# Altium schematic sheet MIXR Input - Instrument Inputs.SchDoc: Instrument Inputs
size B; Organization: Midnight Sun Solar Rayce Car Team; Address1: University of Waterloo; Address2: 200 University Ave W; Address3: Waterloo, ON, Canada; Address4: N2L 3E9; DocumentNumber: 3; SheetNumber: 3; SheetTotal: 14; Website: www.uwmidsun.com; ProjectName: ProjectName
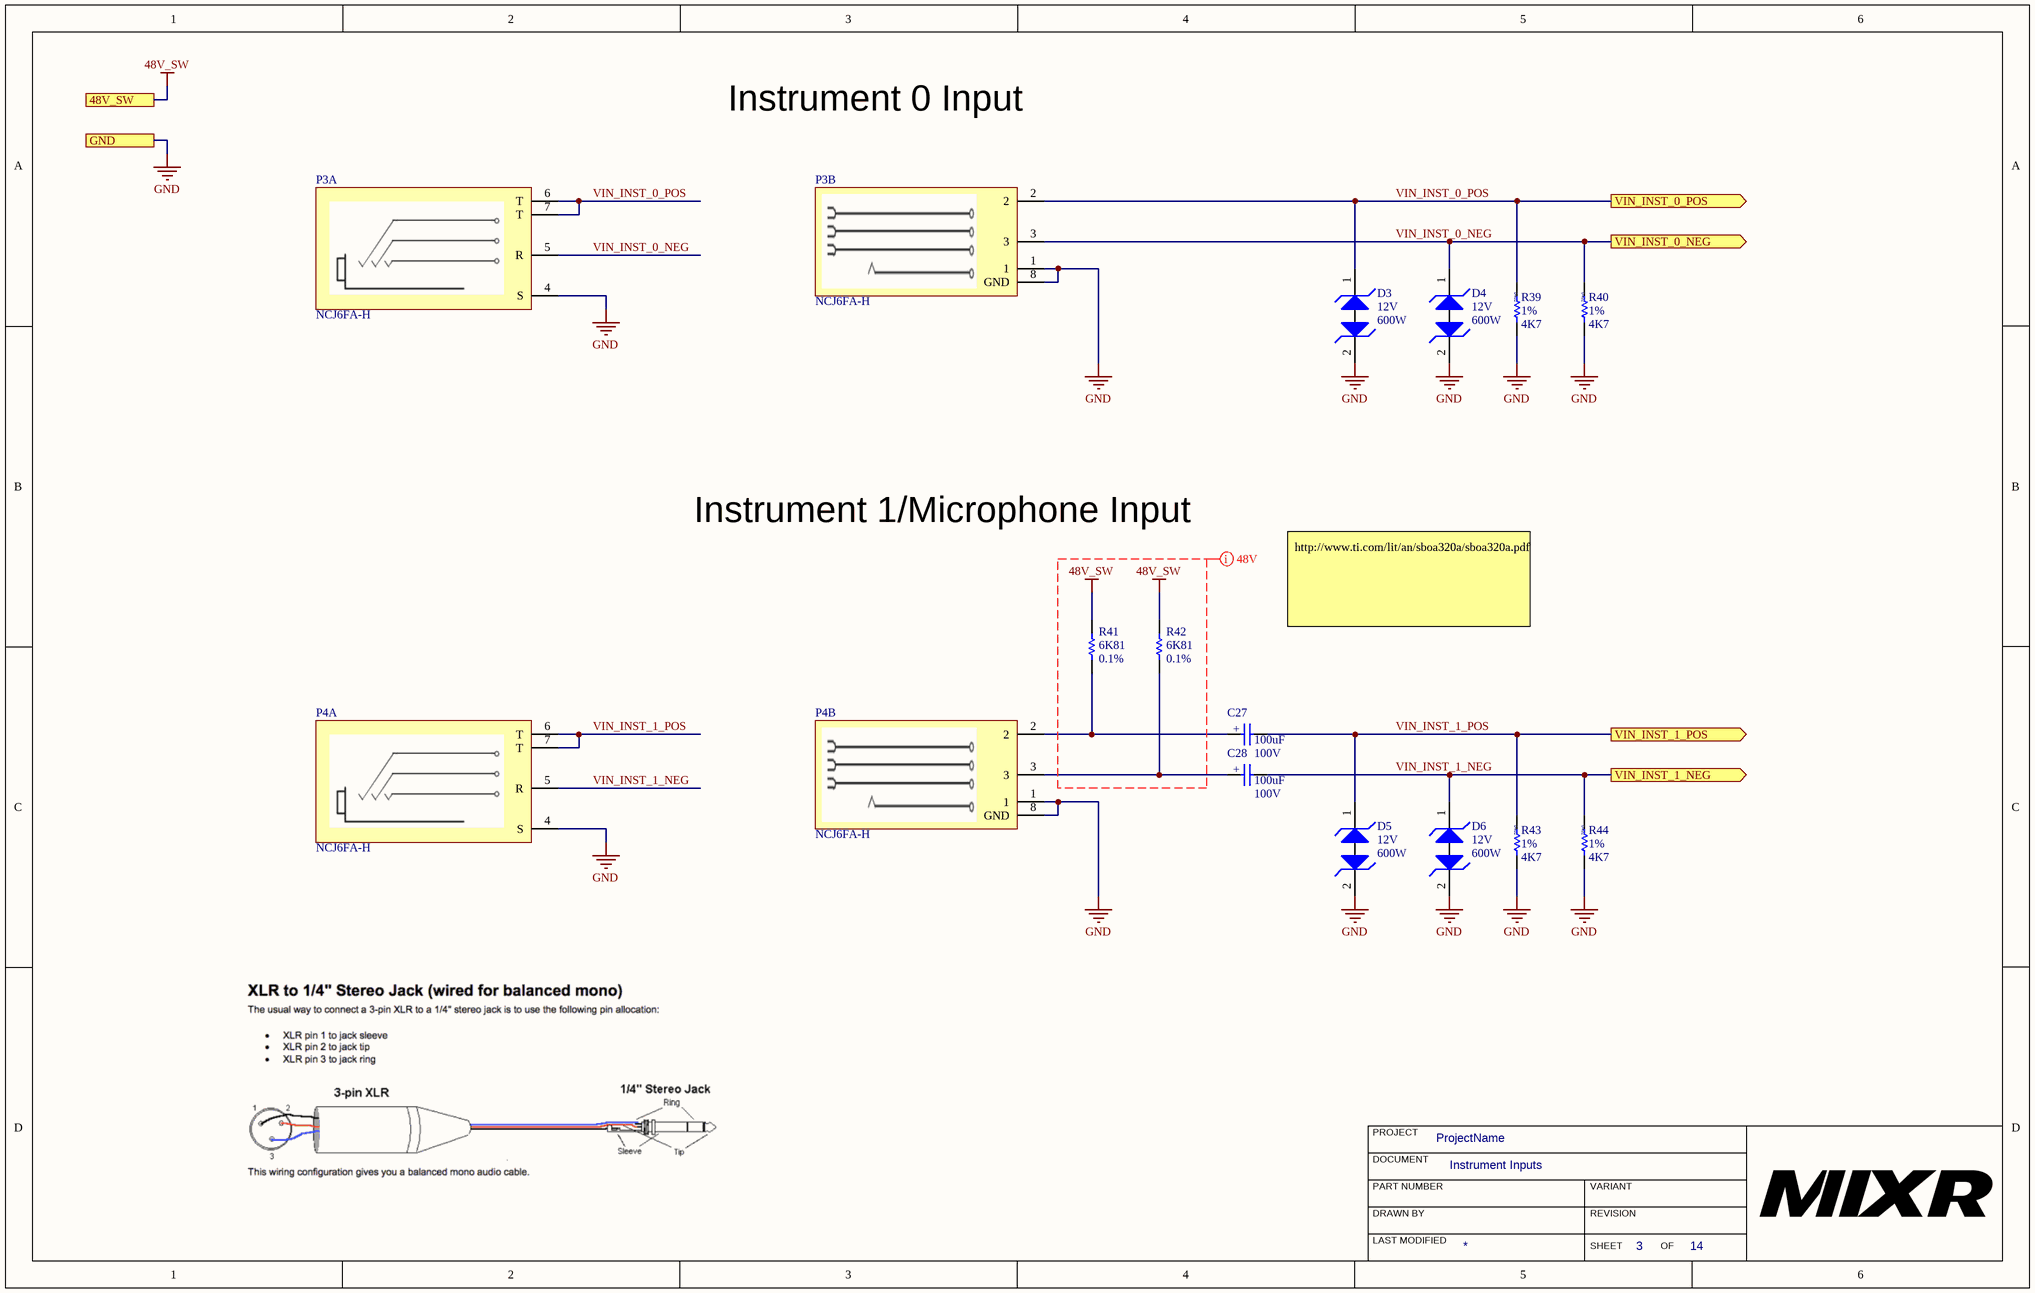
[diagram p0: MIXR Input - Instrument Inputs.SchDoc]

## Parts
C27  Capacitance: 100uF  Voltage Rating: 100V  [CAP ALUM RADIAL 10x20]  (hidden comment: CAP ALUM 100UF 20% 100V RADIAL)
C28  Capacitance: 100uF  Voltage Rating: 100V  [CAP ALUM RADIAL 10x20]  (hidden comment: CAP ALUM 100UF 20% 100V RADIAL)
D3  Voltage - Reverse Standoff (Typ): 12V  Power - Peak Pulse: 600W  [DO-214AA Diode - BI]  (hidden comment: DIODE TVS 12VWM 19.6VC DO-214AA (SMB))
D4  Voltage - Reverse Standoff (Typ): 12V  Power - Peak Pulse: 600W  [DO-214AA Diode - BI]  (hidden comment: DIODE TVS 12VWM 19.6VC DO-214AA (SMB))
D5  Voltage - Reverse Standoff (Typ): 12V  Power - Peak Pulse: 600W  [DO-214AA Diode - BI]  (hidden comment: DIODE TVS 12VWM 19.6VC DO-214AA (SMB))
D6  Voltage - Reverse Standoff (Typ): 12V  Power - Peak Pulse: 600W  [DO-214AA Diode - BI]  (hidden comment: DIODE TVS 12VWM 19.6VC DO-214AA (SMB))
P3  Manufacturer Part Number: NCJ6FA-H  [CONN XLR-TRS COMBO 3 POLE]  (hidden comment: CONN XLR-TRS COMBO 3 POLE)  (parts A,B of 2)
P4  Manufacturer Part Number: NCJ6FA-H  [CONN XLR-TRS COMBO 3 POLE]  (hidden comment: CONN XLR-TRS COMBO 3 POLE)  (parts A,B of 2)
R39  Tolerance: 1%  Resistance: 4K7  [RES 0402]  (hidden comment: RES 4.7K OHM 1% 1/10W 0402)
R40  Tolerance: 1%  Resistance: 4K7  [RES 0402]  (hidden comment: RES 4.7K OHM 1% 1/10W 0402)
R41  Tolerance: 0.1%  Resistance: 6K81  [RES, 0603]  (hidden comment: RES 6.81k OHM 0.1% 1/10W 0603)
R42  Tolerance: 0.1%  Resistance: 6K81  [RES, 0603]  (hidden comment: RES 6.81k OHM 0.1% 1/10W 0603)
R43  Tolerance: 1%  Resistance: 4K7  [RES 0402]  (hidden comment: RES 4.7K OHM 1% 1/10W 0402)
R44  Tolerance: 1%  Resistance: 4K7  [RES 0402]  (hidden comment: RES 4.7K OHM 1% 1/10W 0402)

## Ports
48V_SW, GND, VIN_INST_0_NEG (out), VIN_INST_0_POS (out), VIN_INST_1_NEG (out), VIN_INST_1_POS (out)

## Nets
48V_SW: R41.1 R42.1 ; port 48V_SW
GND: D3.2(Cathode2) D4.2(Cathode2) D5.2(Cathode2) D6.2(Cathode2) P3.1 P3.4(S) P3.8(GND) P4.1 P4.4(S) P4.8(GND) R39.2 R40.2 R43.2 R44.2 ; port GND
VIN_INST_0_NEG: D4.1(Cathode1) P3.3 P3.5(R) R40.1 ; port VIN_INST_0_NEG
VIN_INST_0_POS: D3.1(Cathode1) P3.2 P3.6(T) P3.7(T) R39.1 ; port VIN_INST_0_POS
VIN_INST_1_NEG: C28.2 D6.1(Cathode1) P4.5(R) R44.1 ; port VIN_INST_1_NEG
VIN_INST_1_POS: C27.2 D5.1(Cathode1) P4.6(T) P4.7(T) R43.1 ; port VIN_INST_1_POS
NetC27_1: C27.1 P4.2 R41.2
NetC28_1: C28.1 P4.3 R42.2

## Layout directives
mark named 48V: 48V_SW

## Notes on the sheet
- Instrument 0 Input
- Instrument 1/Microphone Input
- http://www.ti.com/lit/an/sboa320a/sboa320a.pdf
- PROJECT
- DOCUMENT
- DRAWN BY
- LAST MODIFIED
- PART NUMBER
- REVISION
- SHEET
- VARIANT
- OF
- (in symbol CAP ALUM 100UF 20% 100V RADIAL) +

## Library data of the parts
C27 C28 = CAP ALUM 100UF 20% 100V RADIAL: Manufacturer: Nichicon; Manufacturer Part Number: UFW2A101MPD1TD; Ripple Current: 350mA; Life (Hours): 2000Hour; Supplier 1: Digi-Key; RoHS: Yes; Stock 1: 465; Pricing 1: 1=0.72000, 10=0.53000, 100=0.36360 (USD); Supplier Part Number 1: 493-11050-1-ND; Category: Aluminum Electrolytic Capacitors; Mount: Through Hole; Case/Package: Radial; Min Operating Temperature: -40°C; Max Operating Temperature: 85°C; Package Quantity: 500; Packaging: Tape and Reel; Tolerance: 20%; Lead Pitch: 0.197inch; Height - Seated (Max): 0.866inch; ComponentLink1URL: https://datasheet.ciiva.com/29547/e-fw-29547515.pdf?src-supplier=Digi-Key; ComponentLink1Description: https://datasheet.ciiva.com/29547/e-fw-29547515.pdf?src-supplier=Digi-Key; ComponentLink2URL: https://datasheet.ciiva.com/29547/e-fw-29547516.pdf?src-supplier=Digi-Key; ComponentLink2Description: https://datasheet.ciiva.com/29547/e-fw-29547516.pdf?src-supplier=Digi-Key
D3-D6 = DIODE TVS 12VWM 19.6VC DO-214AA (SMB): TVS DIODE 12V 19.6V DO214AA; Manufacturer: Vishay Semiconductor Diodes Division; Manufacturer Part Number: SMBJ12CD-M3/H; Type: Zener; Voltage - Breakdown (Min): 13.5V; Current - Peak Pulse (10/1000µs): 30.6A; Power Line Protection: No; Supplier 1: Digi-Key; RoHS: RoHS Compliant; Category: Circuit Protection; Stock 1: 4469; Pricing 1: 1=0.69, 10=0.565, 25=0.516, 100=0.3841, 250=0.34808 (CAD); Packaging: Cut Tape (CT); Part Status: Active; Voltage - Clamping (Max) @ Ipp: 19.6V; Applications: General Purpose; Capacitance @ Frequency: -; Operating Temperature: -55°C ~ 150°C (TJ); Mounting Type: Surface Mount; Package / Case: DO-214AA, SMB; Supplier Device Package: DO-214AA (SMBJ); ComponentLink1URL: http://www.vishay.com/docs/87606/87606.pdf; ComponentLink1Description: http://www.vishay.com/docs/87606/87606.pdf; Supplier Part Number 1: SMBJ12CD-M3/HGICT-ND
P3 P4 = CONN XLR-TRS COMBO 3 POLE: XLR Connectors A SERIES COMBO;3POLE FEM;PCB HOR; Manufacturer_Name: Neutrik; Body Material: Metal; Gender: Female; Current Rating: 3A; Voltage Rating: 50V; Number of Positions: 3; Number of Ports: 1; Number of Contacts: 6; Connector Type: Socket; Datasheet Link: http://www.neutrik.com/zoolu-website/media/download/13540/Product+Guide+-+Section+XLR; Manufacturer_Part_Number: NCJ6FA-H; Mouser Part Number: 568-NCJ6FA-H; Mouser Price/Stock: https://www.mouser.com/Search/Refine.aspx?Keyword=568-NCJ6FA-H; Supplier 1: Mouser; Supplier Part Number 1: 568-NCJ6FA-H; Manufacturer: Neutrik; Stock 1: 3848; Pricing 1: 1 = 2.06000, 10 = 1.96000, 50 = 1.86000, 100 = 1.80000, 1000 = 1.77000, 10000 = 1.77000 (USD); RoHS: Yes; Case/Package: Metal; Number of Pins: 3; Weight: 0.388014oz; Contact Material: Bronze; Contact Plating: Gold; Number of Terminals: 6; Housing Material: Polyamide; Color: Black; Min Operating Temperature: -30°C; Max Operating Temperature: 80°C; Package Quantity: 10; Termination: Solder; Orientation: Horizontal; Length: 25mm; Depth: 30.2mm; REACH SVHC: No SVHC; Flammability Rating: UL94 HB; ComponentLink1URL: https://datasheet.ciiva.com/30126/neutrik-ncj6fa-h-1-30126129.pdf?src-supplier=Onlinecomponents.com; ComponentLink1Description: https://datasheet.ciiva.com/30126/neutrik-ncj6fa-h-1-30126129.pdf?src-supplier=Onlinecomponents.com; ComponentLink2URL: https://datasheet.ciiva.com/8008/76755-8008003.pdf?src-supplier=Element14; ComponentLink2Description: https://datasheet.ciiva.com/8008/76755-8008003.pdf?src-supplier=Element14; ComponentLink3URL: https://datasheet.ciiva.com/24394/neutrik-ncj6fa-h-1-24394955.pdf?src-supplier=Onlinecomponents.com; ComponentLink3Description: https://datasheet.ciiva.com/24394/neutrik-ncj6fa-h-1-24394955.pdf?src-supplier=Onlinecomponents.com
R39 R40 R43 R44 = RES 4.7K OHM 1% 1/10W 0402: YAGEO (PHYCOMP) - RC0402FR-074K7L - RES, THICK FILM, 4K7, 1%, 0.063W, 0402; Voltage Rating (DC): 50V; Power Rating: 62.5mW; Temperature Coefficient: 100ppm/°C; Supplier 1: Digi-Key; Manufacturer: Yageo; Manufacturer Part Number: RC0402FR-074K7L; RoHS: Yes; Category: Chip SMD Resistors; Stock 1: 11223879; Pricing 1: 1=0.10000, 10=0.01600, 100=0.00640, 1000=0.00289, 2500=0.00251, 5000=0.00207 (USD); Case/Package: 0402; Number of Pins: 2; Case Code (Imperial): 0402; Case Code (Metric): 1005; Min Operating Temperature: -55°C; Max Operating Temperature: 155°C; Voltage Rating: 50V; Packaging: Tape and Reel; Composition: Thick Film; Termination: SMD/SMT; Military Standard: Not; Length: 1mm; Height: 0.32mm; Width: 0.5mm; Depth: 0.5mm; REACH SVHC: No SVHC; Lead Free: Lead Free; ComponentLink1URL: https://datasheet.ciiva.com/7850/1018594-7850022.pdf?src-supplier=Element14; ComponentLink1Description: https://datasheet.ciiva.com/7850/1018594-7850022.pdf?src-supplier=Element14; ComponentLink2URL: https://datasheet.ciiva.com/7850/1018594-7850023.pdf?src-supplier=Element14; ComponentLink2Description: https://datasheet.ciiva.com/7850/1018594-7850023.pdf?src-supplier=Element14; ComponentLink3URL: https://datasheet.ciiva.com/15215/getdatasheetpartid-328119-15215035.pdf?src-supplier=Verical; ComponentLink3Description: https://datasheet.ciiva.com/15215/getdatasheetpartid-328119-15215035.pdf?src-supplier=Verical; ComponentLink4URL: https://datasheet.ciiva.com/22661/1686128-22661342.pdf?src-supplier=Element14; ComponentLink4Description: https://datasheet.ciiva.com/22661/1686128-22661342.pdf?src-supplier=Element14; Supplier Part Number 1: 311-4.7KLRCT-ND
R41 R42 = RES 6.81k OHM 0.1% 1/10W 0603: RES SMD 6.81K OHM 0.1% 1/5W 0603; Manufacturer: Panasonic; Manufacturer Part Number: ERJ-PB3B6811V; Max Power Dissipation: 200mW; Temperature Coefficient: 50ppm/°C; ComponentLink1URL: https://www.seielect.com/Catalog/SEI-RMCF_RMCP.pdf; ComponentLink1Description: https://www.seielect.com/Catalog/SEI-RMCF_RMCP.pdf; Supplier 1: Digi-Key; RoHS: Yes; Category: Chip SMD Resistors; Stock 1: 4623; Pricing 1: 1=0.25000, 10=0.21100, 25=0.15320, 50=0.11100, 100=0.08230, 250=0.06316, 500=0.04976, 1000=0.03445 (USD); Case/Package: 0603; Case Code (Metric): 1608; Case Code (Imperial): 0603; Min Operating Temperature: -55°C; Max Operating Temperature: 155°C; Packaging: Tape and Reel; Composition: Thick Film; Number of Terminations: 2; Features: Automotive AEC-Q200; Length: 0.063inch; Width: 0.032inch; Height - Seated (Max): 0.022inch; ComponentLink2URL: https://industrial.panasonic.com/sa/system/files/data/download/catalog/id_fixed-resistors_e_2.pdf?src-supplier=Digi-Key; ComponentLink2Description: https://industrial.panasonic.com/sa/system/files/data/download/catalog/id_fixed-resistors_e_2.pdf?src-supplier=Digi-Key; Supplier Part Number 1: P20068CT-ND